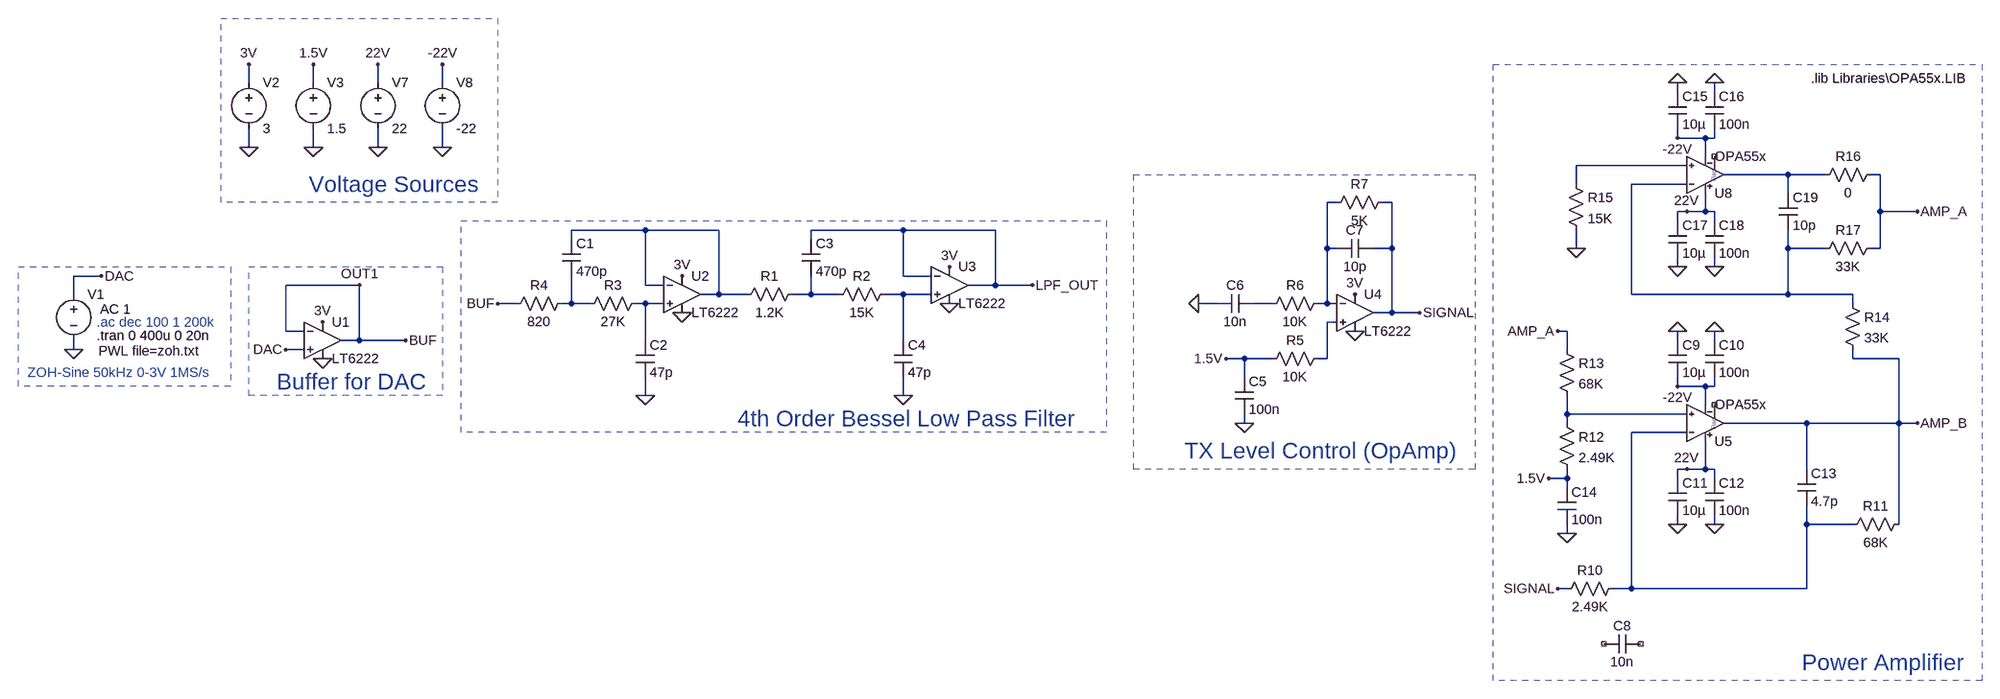
[diagram p0: schematic Custom UAM.asc]
Custom UAM.asc, the LTspice schematic file:
Version 4.1
SHEET 1 2852 680
WIRE -432 -640 -432 -672
WIRE -320 -640 -320 -672
WIRE -208 -640 -208 -672
WIRE -96 -640 -96 -672
WIRE 2048 -624 2048 -640
WIRE 2112 -624 2112 -640
WIRE 2048 -544 2048 -560
WIRE 2096 -544 2048 -544
WIRE 2112 -544 2112 -560
WIRE 2112 -544 2096 -544
WIRE -432 -528 -432 -560
WIRE -320 -528 -320 -560
WIRE -208 -528 -208 -560
WIRE -96 -528 -96 -560
WIRE 2096 -512 2096 -544
WIRE 2064 -496 1872 -496
WIRE 2240 -480 2128 -480
WIRE 2304 -480 2240 -480
WIRE 2400 -480 2384 -480
WIRE 1872 -464 1872 -496
WIRE 2064 -464 1968 -464
WIRE 2240 -448 2240 -480
WIRE 1456 -432 1440 -432
WIRE 1552 -432 1536 -432
WIRE 2064 -416 2048 -416
WIRE 2096 -416 2096 -448
WIRE 2096 -416 2064 -416
WIRE 2112 -416 2096 -416
WIRE 2400 -416 2400 -480
WIRE 2464 -416 2400 -416
WIRE 2048 -400 2048 -416
WIRE 2112 -400 2112 -416
WIRE 256 -384 128 -384
WIRE 384 -384 256 -384
WIRE 704 -384 544 -384
WIRE 864 -384 704 -384
WIRE 128 -368 128 -384
WIRE 544 -368 544 -384
WIRE 1440 -352 1440 -432
WIRE 1456 -352 1440 -352
WIRE 1552 -352 1552 -432
WIRE 1552 -352 1520 -352
WIRE 1872 -352 1872 -384
WIRE 2240 -352 2240 -384
WIRE 2304 -352 2240 -352
WIRE 2400 -352 2400 -416
WIRE 2400 -352 2384 -352
WIRE 2048 -320 2048 -336
WIRE 2112 -320 2112 -336
WIRE -688 -304 -736 -304
WIRE 704 -304 704 -384
WIRE 752 -304 704 -304
WIRE -240 -288 -368 -288
WIRE 256 -288 256 -384
WIRE 288 -288 256 -288
WIRE 864 -288 864 -384
WIRE 864 -288 816 -288
WIRE 928 -288 864 -288
WIRE -736 -272 -736 -304
WIRE 384 -272 384 -384
WIRE 384 -272 352 -272
WIRE 432 -272 384 -272
WIRE 544 -272 544 -304
WIRE 544 -272 512 -272
WIRE 592 -272 544 -272
WIRE 704 -272 672 -272
WIRE 752 -272 704 -272
WIRE 1968 -272 1968 -464
WIRE 2240 -272 2240 -352
WIRE 2240 -272 1968 -272
WIRE 2352 -272 2240 -272
WIRE 32 -256 0 -256
WIRE 128 -256 128 -304
WIRE 128 -256 112 -256
WIRE 160 -256 128 -256
WIRE 256 -256 240 -256
WIRE 288 -256 256 -256
WIRE 1248 -256 1216 -256
WIRE 1344 -256 1312 -256
WIRE 1440 -256 1440 -352
WIRE 1440 -256 1424 -256
WIRE 1456 -256 1440 -256
WIRE 2352 -256 2352 -272
WIRE 1552 -240 1552 -352
WIRE 1552 -240 1520 -240
WIRE 1600 -240 1552 -240
WIRE 1456 -224 1440 -224
WIRE -368 -208 -368 -288
WIRE -336 -208 -368 -208
WIRE 1856 -208 1840 -208
WIRE -240 -192 -240 -288
WIRE -240 -192 -272 -192
WIRE -160 -192 -240 -192
WIRE 256 -192 256 -256
WIRE 704 -192 704 -272
WIRE 2048 -192 2048 -208
WIRE 2112 -192 2112 -208
WIRE -736 -176 -736 -192
WIRE -336 -176 -368 -176
WIRE 1856 -176 1856 -208
WIRE 1296 -160 1264 -160
WIRE 1344 -160 1296 -160
WIRE 1440 -160 1440 -224
WIRE 1440 -160 1424 -160
WIRE 2352 -160 2352 -176
WIRE 2432 -160 2352 -160
WIRE 1296 -128 1296 -160
WIRE 2048 -112 2048 -128
WIRE 2096 -112 2048 -112
WIRE 2112 -112 2112 -128
WIRE 2112 -112 2096 -112
WIRE 256 -96 256 -128
WIRE 704 -96 704 -128
WIRE 2096 -80 2096 -112
WIRE 1856 -64 1856 -96
WIRE 2064 -64 1856 -64
WIRE 1296 -48 1296 -64
WIRE 1856 -48 1856 -64
WIRE 2272 -48 2128 -48
WIRE 2432 -48 2432 -160
WIRE 2432 -48 2272 -48
WIRE 2464 -48 2432 -48
WIRE 2064 -32 1968 -32
WIRE 2064 32 2048 32
WIRE 2096 32 2096 -16
WIRE 2096 32 2064 32
WIRE 2112 32 2096 32
WIRE 2272 32 2272 -48
WIRE 1856 48 1856 32
WIRE 1856 48 1824 48
WIRE 2048 48 2048 32
WIRE 2112 48 2112 32
WIRE 1856 64 1856 48
WIRE 2048 128 2048 112
WIRE 2112 128 2112 112
WIRE 2272 128 2272 96
WIRE 2352 128 2272 128
WIRE 2432 128 2432 -48
WIRE 1856 144 1856 128
WIRE 1856 240 1840 240
WIRE 1968 240 1968 -32
WIRE 1968 240 1936 240
WIRE 2272 240 2272 128
WIRE 2272 240 1968 240
FLAG -736 -176 0
FLAG -304 -160 0
FLAG -432 -528 0
FLAG -240 -288 OUT1
FLAG -432 -672 3V
FLAG -304 -224 3V
FLAG 256 -96 0
FLAG 704 -96 0
FLAG 928 -288 LPF_OUT
FLAG 320 -304 3V
FLAG 784 -320 3V
FLAG 320 -240 0
FLAG 784 -256 0
FLAG -160 -192 BUF
FLAG 1296 -48 0
FLAG 1264 -160 1.5V
FLAG 1600 -240 SIGNAL
FLAG 1488 -272 3V
FLAG 1488 -208 0
FLAG -320 -528 0
FLAG -320 -672 1.5V
FLAG -208 -528 0
FLAG -208 -672 22V
FLAG -96 -528 0
FLAG -96 -672 -22V
FLAG 2064 32 22V
FLAG 2048 128 0
FLAG 2112 128 0
FLAG 2048 -208 0
FLAG 2112 -208 0
FLAG 2048 -112 -22V
FLAG 1856 144 0
FLAG 1824 48 1.5V
FLAG 1840 -208 AMP_A
FLAG 1840 240 SIGNAL
FLAG 2464 -48 AMP_B
FLAG 2048 -640 0
FLAG 2112 -640 0
FLAG 2048 -544 -22V
FLAG 2064 -416 22V
FLAG 2048 -320 0
FLAG 2112 -320 0
FLAG 1872 -352 0
FLAG 2464 -416 AMP_A
FLAG -688 -304 DAC
FLAG 0 -256 BUF
FLAG -368 -176 DAC
FLAG 1216 -256 0
SYMBOL voltage -736 -288 R0
WINDOW 3 43 114 Left 2
WINDOW 123 46 42 Left 2
WINDOW 39 0 0 Left 0
SYMATTR Value PWL file=zoh.txt
SYMATTR Value2 AC 1
SYMATTR InstName V1
SYMBOL OpAmps\\LT6222 -304 -192 R0
SYMATTR InstName U1
SYMBOL voltage -432 -656 R0
WINDOW 123 0 0 Left 0
WINDOW 39 0 0 Left 0
SYMATTR InstName V2
SYMATTR Value 3
SYMBOL OpAmps\\LT6222 320 -272 R0
SYMATTR InstName U2
SYMBOL OpAmps\\LT6222 784 -288 R0
SYMATTR InstName U3
SYMBOL res 528 -288 R90
WINDOW 0 0 56 VBottom 2
WINDOW 3 32 56 VTop 2
SYMATTR InstName R1
SYMATTR Value 1.2K
SYMBOL res 688 -288 R90
WINDOW 0 0 56 VBottom 2
WINDOW 3 32 56 VTop 2
SYMATTR InstName R2
SYMATTR Value 15K
SYMBOL res 256 -272 R90
WINDOW 0 0 56 VBottom 2
WINDOW 3 32 56 VTop 2
SYMATTR InstName R3
SYMATTR Value 27K
SYMBOL res 128 -272 R90
WINDOW 0 0 56 VBottom 2
WINDOW 3 32 56 VTop 2
SYMATTR InstName R4
SYMATTR Value 820
SYMBOL cap 112 -368 R0
SYMATTR InstName C1
SYMATTR Value 470p
SYMBOL cap 240 -192 R0
SYMATTR InstName C2
SYMATTR Value 47p
SYMBOL cap 528 -368 R0
SYMATTR InstName C3
SYMATTR Value 470p
SYMBOL cap 688 -192 R0
SYMATTR InstName C4
SYMATTR Value 47p
SYMBOL OpAmps\\LT6222 1488 -240 R0
SYMATTR InstName U4
SYMBOL res 1440 -176 R90
WINDOW 0 0 56 VBottom 2
WINDOW 3 32 56 VTop 2
SYMATTR InstName R5
SYMATTR Value 10K
SYMBOL cap 1280 -128 R0
SYMATTR InstName C5
SYMATTR Value 100n
SYMBOL res 1440 -272 R90
WINDOW 0 0 56 VBottom 2
WINDOW 3 32 56 VTop 2
SYMATTR InstName R6
SYMATTR Value 10K
SYMBOL cap 1248 -240 R270
WINDOW 0 32 32 VTop 2
WINDOW 3 0 32 VBottom 2
SYMATTR InstName C6
SYMATTR Value 10n
SYMBOL cap 1456 -336 R270
WINDOW 0 32 32 VTop 2
WINDOW 3 0 32 VBottom 2
SYMATTR InstName C7
SYMATTR Value 10p
SYMBOL res 1552 -448 R90
WINDOW 0 0 56 VBottom 2
WINDOW 3 32 56 VTop 2
SYMATTR InstName R7
SYMATTR Value 5K
SYMBOL voltage -320 -656 R0
WINDOW 123 0 0 Left 0
WINDOW 39 0 0 Left 0
SYMATTR InstName V3
SYMATTR Value 1.5
SYMBOL cap 1984 320 R90
WINDOW 0 0 32 VBottom 2
WINDOW 3 32 32 VTop 2
SYMATTR InstName C8
SYMATTR Value 10n
SYMBOL res 1952 224 R90
WINDOW 0 0 56 VBottom 2
WINDOW 3 32 56 VTop 2
SYMATTR InstName R10
SYMATTR Value 2.49K
SYMBOL cap 2032 -192 R0
SYMATTR InstName C9
SYMATTR Value 10µ
SYMBOL cap 2096 -192 R0
SYMATTR InstName C10
SYMATTR Value 100n
SYMBOL cap 2032 48 R0
SYMATTR InstName C11
SYMATTR Value 10µ
SYMBOL cap 2096 48 R0
SYMATTR InstName C12
SYMATTR Value 100n
SYMBOL voltage -208 -656 R0
WINDOW 123 0 0 Left 0
WINDOW 39 0 0 Left 0
SYMATTR InstName V7
SYMATTR Value 22
SYMBOL voltage -96 -656 R0
WINDOW 123 0 0 Left 0
WINDOW 39 0 0 Left 0
SYMATTR InstName V8
SYMATTR Value -22
SYMBOL cap 2256 32 R0
SYMATTR InstName C13
SYMATTR Value 4.7p
SYMBOL res 2448 112 R90
WINDOW 0 0 56 VBottom 2
WINDOW 3 32 56 VTop 2
SYMATTR InstName R11
SYMATTR Value 68K
SYMBOL cap 1840 64 R0
SYMATTR InstName C14
SYMATTR Value 100n
SYMBOL res 1840 -64 R0
SYMATTR InstName R12
SYMATTR Value 2.49K
SYMBOL res 1840 -192 R0
SYMATTR InstName R13
SYMATTR Value 68K
SYMBOL res 2336 -272 R0
SYMATTR InstName R14
SYMATTR Value 33K
SYMBOL cap 2032 -624 R0
SYMATTR InstName C15
SYMATTR Value 10µ
SYMBOL cap 2096 -624 R0
SYMATTR InstName C16
SYMATTR Value 100n
SYMBOL cap 2032 -400 R0
SYMATTR InstName C17
SYMATTR Value 10µ
SYMBOL cap 2096 -400 R0
SYMATTR InstName C18
SYMATTR Value 100n
SYMBOL res 1856 -480 R0
SYMATTR InstName R15
SYMATTR Value 15K
SYMBOL cap 2224 -448 R0
SYMATTR InstName C19
SYMATTR Value 10p
SYMBOL res 2288 -464 R270
WINDOW 0 32 56 VTop 2
WINDOW 3 0 56 VBottom 2
SYMATTR InstName R16
SYMATTR Value 0
SYMBOL res 2400 -368 R90
WINDOW 0 0 56 VBottom 2
WINDOW 3 32 56 VTop 2
SYMATTR InstName R17
SYMATTR Value 33K
SYMBOL Libraries\\OPA55x 2096 16 M180
SYMATTR InstName U5
SYMBOL Libraries\\OPA55x 2096 -416 M180
SYMATTR InstName U8
TEXT -696 -200 Left 2 !.tran 0 400u 0 20n
TEXT -696 -224 Left 2 ;.ac dec 100 1 200k
TEXT 416 -56 Left 4 ;4th Order Bessel Low Pass Filter
TEXT 1192 0 Left 4 ;TX Level Control (OpAmp)
TEXT 2264 368 Left 4 ;Power Amplifier
TEXT -816 -136 Left 2 ;ZOH-Sine 50kHz 0-3V 1MS/s
TEXT -328 -464 Left 4 ;Voltage Sources
TEXT -384 -120 Left 4 ;Buffer for DAC
TEXT 2280 -648 Left 2 !.lib Libraries\\OPA55x.LIB
RECTANGLE Normal 1056 -32 -64 -400 1
RECTANGLE Normal 2576 400 1728 -672 1
RECTANGLE Normal 1104 -480 1696 32 1
RECTANGLE Normal -480 -752 0 -432 1
RECTANGLE Normal -464 -112 -832 -320 1
RECTANGLE Normal -96 -96 -432 -320 1

The netlist it stands for:
* Custom UAM.asc
V1 DAC 0 PWL file=zoh.txt AC 1
* U1: LT6222 (symbol OpAmps\LT6222 not available, pins judged from their places): In+=DAC In-=BUF V+=3V V-=0 OUT=BUF
V2 3V 0 3
* U2: LT6222 (symbol OpAmps\LT6222 not available, pins judged from their places): In+=N009 In-=N005 V+=3V V-=0 OUT=N005
* U3: LT6222 (symbol OpAmps\LT6222 not available, pins judged from their places): In+=N007 In-=LPF_OUT V+=3V V-=0 OUT=LPF_OUT
R1 N006 N005 1.2K
R2 N007 N006 15K
R3 N009 N008 27K
R4 N008 BUF 820
C1 N005 N008 470p
C2 N009 0 47p
C3 LPF_OUT N006 470p
C4 N007 0 47p
* U4: LT6222 (symbol OpAmps\LT6222 not available, pins judged from their places): In+=N011 In-=N004 V+=3V V-=0 OUT=SIGNAL
R5 N011 1.5V 10K
C5 1.5V 0 100n
R6 N004 N010 10K
C6 0 N010 10n
C7 N004 SIGNAL 10p
R7 SIGNAL N004 5K
V3 1.5V 0 1.5
C8 NC_01 NC_02 10n
R10 N013 SIGNAL 2.49K
C9 0 -22V 10µ
C10 0 -22V 100n
C11 22V 0 10µ
C12 22V 0 100n
V7 22V 0 22
V8 -22V 0 -22
C13 AMP_B N013 4.7p
R11 AMP_B N013 68K
C14 1.5V 0 100n
R12 N012 1.5V 2.49K
R13 AMP_A N012 68K
R14 N003 AMP_B 33K
C15 0 -22V 10µ
C16 0 -22V 100n
C17 22V 0 10µ
C18 22V 0 100n
R15 N001 0 15K
C19 N002 N003 10p
R16 N002 AMP_A 0
R17 AMP_A N003 33K
X§U5 N012 N013 22V -22V AMP_B NC_03 OPA55x  ; pins In+ In- V+ V- OUT Flag
X§U8 N001 N003 22V -22V N002 NC_04 OPA55x  ; pins In+ In- V+ V- OUT Flag
.tran 0 400u 0 20n
* .ac dec 100 1 200k
* 4th Order Bessel Low Pass Filter
* TX Level Control (OpAmp)
* Power Amplifier
* ZOH-Sine 50kHz 0-3V 1MS/s
* Voltage Sources
* Buffer for DAC
.lib Libraries\OPA55x.LIB
.lib OPA55x.LIB
.backanno
.end